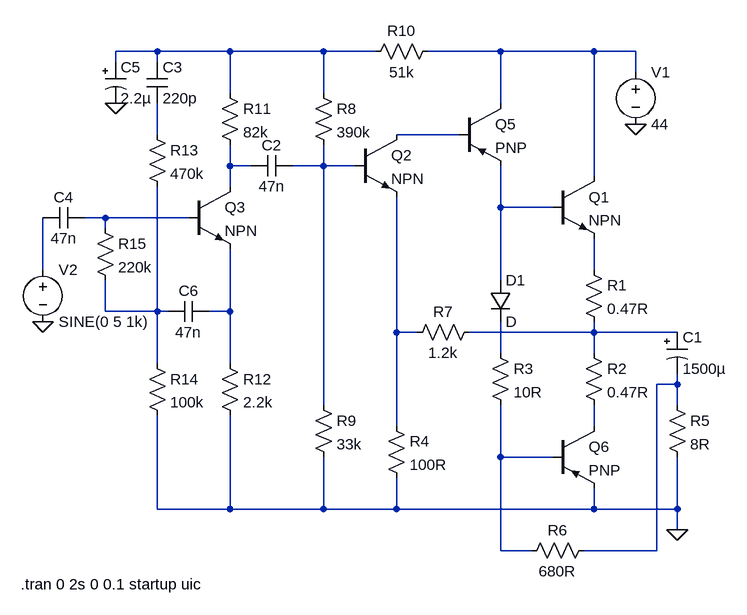
[diagram p0: schematic amp_80W_newto_braga.asc]
amp_80W_newto_braga.asc, the LTspice schematic file:
Version 4
SHEET 1 880 772
WIRE -336 -64 -400 -64
WIRE -224 -64 -336 -64
WIRE -80 -64 -224 -64
WIRE 0 -64 -80 -64
WIRE 192 -64 80 -64
WIRE 336 -64 192 -64
WIRE 400 -64 336 -64
WIRE -400 -48 -400 -64
WIRE -336 -48 -336 -64
WIRE 400 -32 400 -64
WIRE -224 0 -224 -64
WIRE -80 0 -80 -64
WIRE 192 16 192 -64
WIRE -336 64 -336 16
WIRE 128 64 32 64
WIRE -224 112 -224 80
WIRE -192 112 -224 112
WIRE -80 112 -80 80
WIRE -80 112 -128 112
WIRE -32 112 -80 112
WIRE 336 128 336 -64
WIRE -224 144 -224 112
WIRE 192 176 192 112
WIRE 272 176 192 176
WIRE -416 192 -448 192
WIRE -288 192 -416 192
WIRE -416 208 -416 192
WIRE -512 272 -512 192
WIRE 336 272 336 224
WIRE 192 288 192 176
WIRE -416 336 -416 288
WIRE -336 336 -336 144
WIRE -336 336 -416 336
WIRE -320 336 -336 336
WIRE -224 336 -224 240
WIRE -224 336 -256 336
WIRE 32 368 32 160
WIRE 64 368 32 368
WIRE 336 368 336 352
WIRE 336 368 144 368
WIRE 464 368 336 368
WIRE 192 400 192 352
WIRE 336 400 336 368
WIRE -336 416 -336 336
WIRE -224 416 -224 336
WIRE 464 448 464 432
WIRE 464 448 432 448
WIRE -80 480 -80 112
WIRE 464 480 464 448
WIRE 32 512 32 368
WIRE 336 512 336 480
WIRE 192 560 192 480
WIRE 272 560 192 560
WIRE -336 640 -336 496
WIRE -224 640 -224 496
WIRE -224 640 -336 640
WIRE -80 640 -80 560
WIRE -80 640 -224 640
WIRE 32 640 32 592
WIRE 32 640 -80 640
WIRE 336 640 336 608
WIRE 336 640 32 640
WIRE 464 640 464 560
WIRE 464 640 336 640
WIRE 464 672 464 640
WIRE 464 672 448 672
WIRE 192 704 192 560
WIRE 240 704 192 704
WIRE 432 704 432 448
WIRE 432 704 320 704
FLAG -400 16 0
FLAG 464 672 0
FLAG -512 352 0
FLAG 400 48 0
SYMBOL npn 272 128 R0
SYMATTR InstName Q1
SYMBOL npn -32 64 R0
SYMATTR InstName Q2
SYMBOL npn -288 144 R0
SYMATTR InstName Q3
SYMBOL pnp 128 16 R0
SYMATTR InstName Q5
SYMBOL pnp 272 512 R0
SYMATTR InstName Q6
SYMBOL res 320 256 R0
SYMATTR InstName R1
SYMATTR Value 0.47R
SYMBOL res 320 384 R0
SYMATTR InstName R2
SYMATTR Value 0.47R
SYMBOL res 176 384 R0
SYMATTR InstName R3
SYMATTR Value 10R
SYMBOL res 16 496 R0
SYMATTR InstName R4
SYMATTR Value 100R
SYMBOL diode 176 288 R0
SYMATTR InstName D1
SYMBOL polcap 448 368 R0
WINDOW 3 24 56 Left 2
SYMATTR InstName C1
SYMATTR Value 1500µ
SYMATTR Description Capacitor
SYMATTR Type cap
SYMATTR SpiceLine V=25 Irms=1.73 Rser=0.034 Lser=0 mfg="Panasonic" pn="ECA1EFQ152" type="Al electrolytic"
SYMBOL res 448 464 R0
SYMATTR InstName R5
SYMATTR Value 8R
SYMBOL res 336 688 R90
WINDOW 0 0 56 VBottom 2
WINDOW 3 32 56 VTop 2
SYMATTR InstName R6
SYMATTR Value 680R
SYMBOL res 160 352 R90
WINDOW 0 0 56 VBottom 2
WINDOW 3 32 56 VTop 2
SYMATTR InstName R7
SYMATTR Value 1.2k
SYMBOL res -96 -16 R0
SYMATTR InstName R8
SYMATTR Value 390k
SYMBOL res -96 464 R0
SYMATTR InstName R9
SYMATTR Value 33k
SYMBOL res 96 -80 R90
WINDOW 0 0 56 VBottom 2
WINDOW 3 32 56 VTop 2
SYMATTR InstName R10
SYMATTR Value 51k
SYMBOL cap -128 96 R90
WINDOW 0 0 32 VBottom 2
WINDOW 3 32 32 VTop 2
SYMATTR InstName C2
SYMATTR Value 47n
SYMBOL res -240 -16 R0
SYMATTR InstName R11
SYMATTR Value 82k
SYMBOL res -240 400 R0
SYMATTR InstName R12
SYMATTR Value 2.2k
SYMBOL cap -352 -48 R0
SYMATTR InstName C3
SYMATTR Value 220p
SYMBOL res -352 48 R0
SYMATTR InstName R13
SYMATTR Value 470k
SYMBOL res -352 400 R0
SYMATTR InstName R14
SYMATTR Value 100k
SYMBOL res -432 192 R0
SYMATTR InstName R15
SYMATTR Value 220k
SYMBOL cap -448 176 R90
WINDOW 0 0 32 VBottom 2
WINDOW 3 32 32 VTop 2
SYMATTR InstName C4
SYMATTR Value 47n
SYMBOL polcap -416 -48 R0
SYMATTR InstName C5
SYMATTR Value 2.2µ
SYMATTR Description Capacitor
SYMATTR Type cap
SYMATTR SpiceLine V=50 Irms=18m Rser=10 Lser=0 mfg="Nichicon" pn="UPR1H2R2MAH" type="Al electrolytic"
SYMBOL cap -256 320 R90
WINDOW 0 0 32 VBottom 2
WINDOW 3 32 32 VTop 2
SYMATTR InstName C6
SYMATTR Value 47n
SYMBOL voltage 400 -48 R0
WINDOW 123 0 0 Left 2
WINDOW 39 0 0 Left 2
SYMATTR InstName V1
SYMATTR Value 44
SYMBOL voltage -512 256 R0
WINDOW 123 0 0 Left 2
WINDOW 39 0 0 Left 2
SYMATTR InstName V2
SYMATTR Value SINE(0 5 1k)
TEXT -546 756 Left 2 !.tran 0 2s 0 0.1 startup uic

The netlist it stands for:
* amp_80W_newto_braga.asc
Q1 N002 N007 N010 0 NPN
Q2 N004 N006 N013 0 NPN
Q3 N005 N008 N012 0 NPN
Q5 N002 N004 N007 0 PNP
Q6 N017 N018 0 0 PNP
R1 N010 N014 0.47R
R2 N014 N017 0.47R
R3 N015 N018 10R
R4 N013 0 100R
D1 N007 N015 D
C1 N014 N016 1500µ V=25 Irms=1.73 Rser=0.034 Lser=0 mfg="Panasonic" pn="ECA1EFQ152" type="Al electrolytic"
R5 N016 0 8R
R6 N016 N018 680R
R7 N014 N013 1.2k
R8 N001 N006 390k
R9 N006 0 33k
R10 N002 N001 51k
C2 N006 N005 47n
R11 N001 N005 82k
R12 N012 0 2.2k
C3 N001 N003 220p
R13 N003 N011 470k
R14 N011 0 100k
R15 N008 N011 220k
C4 N008 N009 47n
C5 N001 0 2.2µ V=50 Irms=18m Rser=10 Lser=0 mfg="Nichicon" pn="UPR1H2R2MAH" type="Al electrolytic"
C6 N012 N011 47n
V1 N002 0 44
V2 N009 0 SINE(0 5 1k)
.model D D
.lib standard.dio
.model NPN NPN
.model PNP PNP
.lib standard.bjt
.tran 0 2s 0 0.1 startup uic
.backanno
.end